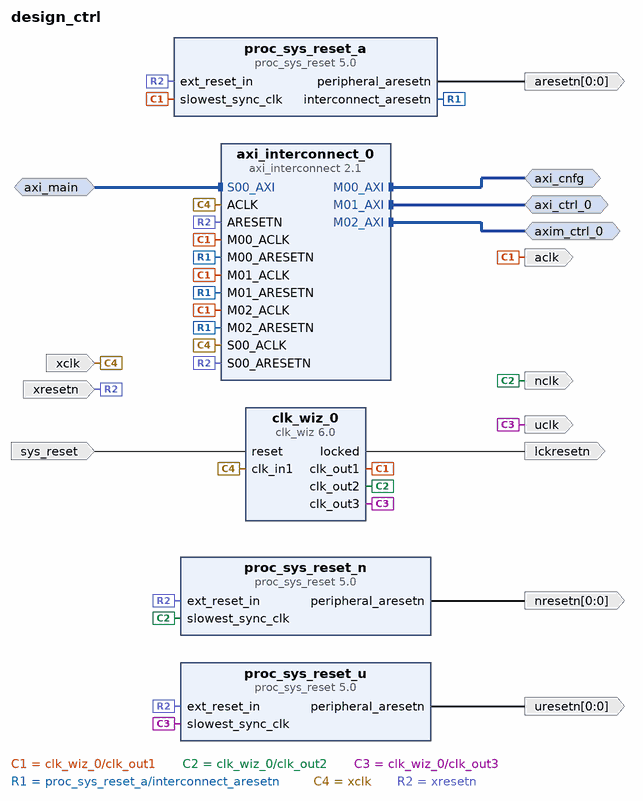
[diagram p0: block diagram of the top level]
# Vivado block design design_ctrl, xcu280-fsvh2892-2L-e, Vivado 2022.1
create_bd_design design_ctrl

create_bd_intf_port -mode Master -vlnv xilinx.com:interface:aximm_rtl:1.0 axi_cnfg
set_property -dict [list \
  CONFIG.ADDR_WIDTH 64 \
  CONFIG.DATA_WIDTH 64 \
  CONFIG.FREQ_HZ 250000000 \
  CONFIG.PROTOCOL AXI4LITE \
] [get_bd_intf_ports axi_cnfg]
create_bd_intf_port -mode Slave -vlnv xilinx.com:interface:aximm_rtl:1.0 axi_main
set_property -dict [list \
  CONFIG.ADDR_WIDTH 64 \
  CONFIG.ARUSER_WIDTH 0 \
  CONFIG.AWUSER_WIDTH 0 \
  CONFIG.BUSER_WIDTH 0 \
  CONFIG.DATA_WIDTH 512 \
  CONFIG.FREQ_HZ 250000000 \
  CONFIG.HAS_BRESP 1 \
  CONFIG.HAS_BURST 1 \
  CONFIG.HAS_CACHE 1 \
  CONFIG.HAS_LOCK 1 \
  CONFIG.HAS_PROT 1 \
  CONFIG.HAS_QOS 1 \
  CONFIG.HAS_REGION 1 \
  CONFIG.HAS_RRESP 1 \
  CONFIG.HAS_WSTRB 1 \
  CONFIG.ID_WIDTH 6 \
  CONFIG.MAX_BURST_LENGTH 16 \
  CONFIG.NUM_READ_OUTSTANDING 8 \
  CONFIG.NUM_READ_THREADS 2 \
  CONFIG.NUM_WRITE_OUTSTANDING 8 \
  CONFIG.NUM_WRITE_THREADS 2 \
  CONFIG.PROTOCOL AXI4 \
  CONFIG.READ_WRITE_MODE READ_WRITE \
  CONFIG.RUSER_BITS_PER_BYTE 0 \
  CONFIG.RUSER_WIDTH 0 \
  CONFIG.SUPPORTS_NARROW_BURST 0 \
  CONFIG.WUSER_BITS_PER_BYTE 0 \
  CONFIG.WUSER_WIDTH 0 \
] [get_bd_intf_ports axi_main]
create_bd_intf_port -mode Master -vlnv xilinx.com:interface:aximm_rtl:1.0 axi_ctrl_0
set_property -dict [list \
  CONFIG.ADDR_WIDTH 64 \
  CONFIG.DATA_WIDTH 64 \
  CONFIG.FREQ_HZ 250000000 \
  CONFIG.PROTOCOL AXI4LITE \
] [get_bd_intf_ports axi_ctrl_0]
create_bd_intf_port -mode Master -vlnv xilinx.com:interface:aximm_rtl:1.0 axim_ctrl_0
set_property -dict [list \
  CONFIG.ADDR_WIDTH 64 \
  CONFIG.DATA_WIDTH 256 \
  CONFIG.FREQ_HZ 250000000 \
  CONFIG.HAS_BRESP 1 \
  CONFIG.HAS_BURST 1 \
  CONFIG.HAS_CACHE 1 \
  CONFIG.HAS_LOCK 1 \
  CONFIG.HAS_PROT 1 \
  CONFIG.HAS_QOS 0 \
  CONFIG.HAS_REGION 0 \
  CONFIG.HAS_RRESP 1 \
  CONFIG.HAS_WSTRB 1 \
  CONFIG.NUM_READ_OUTSTANDING 8 \
  CONFIG.NUM_WRITE_OUTSTANDING 8 \
  CONFIG.PROTOCOL AXI4 \
  CONFIG.READ_WRITE_MODE READ_WRITE \
] [get_bd_intf_ports axim_ctrl_0]
create_bd_port -dir I -type rst xresetn
create_bd_port -dir I -type clk xclk
set_property -dict {CONFIG.ASSOCIATED_BUSIF axi_main CONFIG.ASSOCIATED_RESET xresetn CONFIG.FREQ_HZ 250000000} [get_bd_ports xclk]
create_bd_port -dir O -from 0 -to 0 -type rst aresetn
create_bd_port -dir O -type clk aclk
set_property -dict [list \
  CONFIG.ASSOCIATED_BUSIF axi_cnfg:axi_ctrl_0:axim_ctrl_0 \
  CONFIG.ASSOCIATED_RESET aresetn \
  CONFIG.FREQ_HZ 250000000 \
] [get_bd_ports aclk]
create_bd_port -dir O -from 0 -to 0 -type rst nresetn
create_bd_port -dir O -type clk nclk
set_property -dict {CONFIG.ASSOCIATED_RESET nresetn CONFIG.FREQ_HZ 250000000} [get_bd_ports nclk]
create_bd_port -dir O -from 0 -to 0 -type rst uresetn
create_bd_port -dir O -type clk uclk
set_property -dict {CONFIG.ASSOCIATED_RESET uresetn CONFIG.FREQ_HZ 250000000} [get_bd_ports uclk]
create_bd_port -dir O -type rst lckresetn
create_bd_port -dir I -type rst sys_reset
set_property -dict {CONFIG.POLARITY ACTIVE_HIGH} [get_bd_ports sys_reset]

create_bd_cell -type ip -vlnv xilinx.com:ip:axi_interconnect:2.1 axi_interconnect_0
set_property -dict [list \
  CONFIG.M00_HAS_REGSLICE 4 \
  CONFIG.M01_HAS_REGSLICE 4 \
  CONFIG.M02_HAS_REGSLICE 4 \
  CONFIG.NUM_MI 3 \
  CONFIG.S00_HAS_DATA_FIFO 2 \
  CONFIG.S00_HAS_REGSLICE 4 \
  CONFIG.STRATEGY 2 \
] [get_bd_cells axi_interconnect_0]
create_bd_cell -type ip -vlnv xilinx.com:ip:clk_wiz:6.0 clk_wiz_0
set_property -dict [list \
  CONFIG.CLKOUT1_DRIVES Buffer \
  CONFIG.CLKOUT1_REQUESTED_OUT_FREQ 250 \
  CONFIG.CLKOUT2_DRIVES Buffer \
  CONFIG.CLKOUT2_REQUESTED_OUT_FREQ 250 \
  CONFIG.CLKOUT2_USED true \
  CONFIG.CLKOUT3_DRIVES Buffer \
  CONFIG.CLKOUT3_REQUESTED_OUT_FREQ 250 \
  CONFIG.CLKOUT3_USED true \
  CONFIG.NUM_OUT_CLKS 3 \
  CONFIG.OPTIMIZE_CLOCKING_STRUCTURE_EN true \
  CONFIG.PRIM_IN_FREQ 250.000 \
  CONFIG.SECONDARY_SOURCE Single_ended_clock_capable_pin \
  CONFIG.USE_LOCKED true \
  CONFIG.USE_PHASE_ALIGNMENT true \
  CONFIG.USE_RESET true \
] [get_bd_cells clk_wiz_0]
create_bd_cell -type ip -vlnv xilinx.com:ip:proc_sys_reset:5.0 proc_sys_reset_a
create_bd_cell -type ip -vlnv xilinx.com:ip:proc_sys_reset:5.0 proc_sys_reset_n
create_bd_cell -type ip -vlnv xilinx.com:ip:proc_sys_reset:5.0 proc_sys_reset_u

# ---- connections ----

connect_bd_intf_net [get_bd_intf_ports axi_cnfg] [get_bd_intf_pins axi_interconnect_0/M00_AXI]
connect_bd_intf_net [get_bd_intf_ports axi_ctrl_0] [get_bd_intf_pins axi_interconnect_0/M01_AXI]
connect_bd_intf_net [get_bd_intf_ports axim_ctrl_0] [get_bd_intf_pins axi_interconnect_0/M02_AXI]
connect_bd_intf_net [get_bd_intf_ports axi_main] [get_bd_intf_pins axi_interconnect_0/S00_AXI]
connect_bd_net [get_bd_pins clk_wiz_0/clk_out1] \
  [get_bd_pins proc_sys_reset_a/slowest_sync_clk] [get_bd_ports aclk] [get_bd_pins axi_interconnect_0/M00_ACLK] \
  [get_bd_pins axi_interconnect_0/M01_ACLK] [get_bd_pins axi_interconnect_0/M02_ACLK]
connect_bd_net [get_bd_pins clk_wiz_0/clk_out2] [get_bd_ports nclk] [get_bd_pins proc_sys_reset_n/slowest_sync_clk]
connect_bd_net [get_bd_pins clk_wiz_0/clk_out3] [get_bd_ports uclk] [get_bd_pins proc_sys_reset_u/slowest_sync_clk]
connect_bd_net [get_bd_pins clk_wiz_0/locked] [get_bd_ports lckresetn]
connect_bd_net [get_bd_pins proc_sys_reset_a/interconnect_aresetn] \
  [get_bd_pins axi_interconnect_0/M00_ARESETN] [get_bd_pins axi_interconnect_0/M01_ARESETN] \
  [get_bd_pins axi_interconnect_0/M02_ARESETN]
connect_bd_net [get_bd_pins proc_sys_reset_a/peripheral_aresetn] [get_bd_ports aresetn]
connect_bd_net [get_bd_pins proc_sys_reset_n/peripheral_aresetn] [get_bd_ports nresetn]
connect_bd_net [get_bd_pins proc_sys_reset_u/peripheral_aresetn] [get_bd_ports uresetn]
connect_bd_net [get_bd_ports sys_reset] [get_bd_pins clk_wiz_0/reset]
connect_bd_net [get_bd_ports xclk] [get_bd_pins axi_interconnect_0/ACLK] [get_bd_pins axi_interconnect_0/S00_ACLK] [get_bd_pins clk_wiz_0/clk_in1]
connect_bd_net [get_bd_ports xresetn] \
  [get_bd_pins axi_interconnect_0/ARESETN] [get_bd_pins axi_interconnect_0/S00_ARESETN] \
  [get_bd_pins proc_sys_reset_a/ext_reset_in] [get_bd_pins proc_sys_reset_n/ext_reset_in] \
  [get_bd_pins proc_sys_reset_u/ext_reset_in]

# ---- address map ----
assign_bd_address -offset 0x0000000000000000 -range 32K -target_address_space [get_bd_addr_spaces axi_main] [get_bd_addr_segs axi_cnfg/Reg]
assign_bd_address -offset 0x0000000000100000 -range 256K -target_address_space [get_bd_addr_spaces axi_main] [get_bd_addr_segs axi_ctrl_0/Reg]
assign_bd_address -offset 0x0000000001000000 -range 256K -target_address_space [get_bd_addr_spaces axi_main] [get_bd_addr_segs axim_ctrl_0/Reg]

validate_bd_design
save_bd_design
